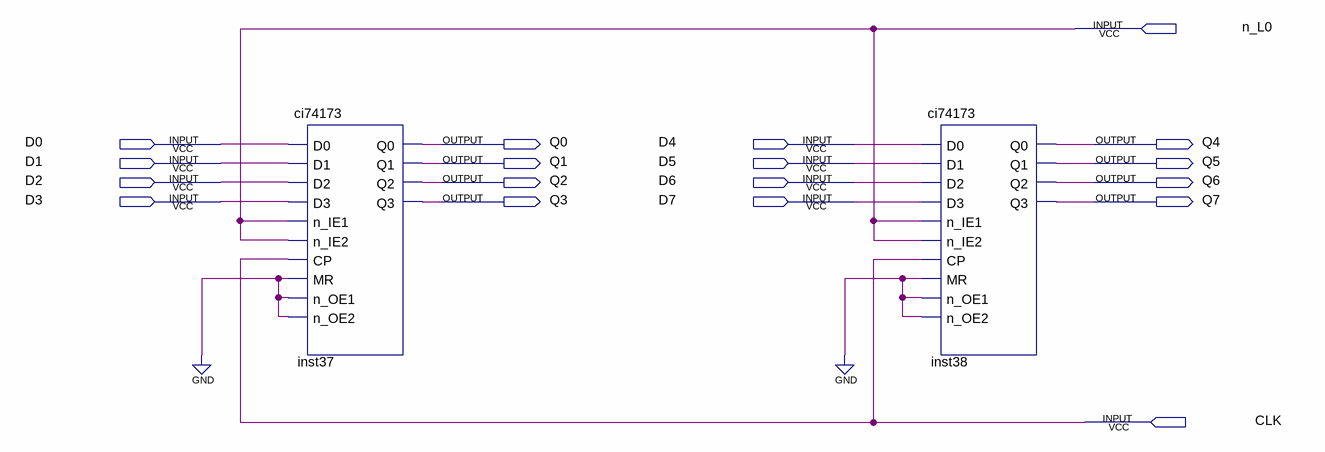
[diagram p0: schematic sheet]
// Quartus schematic RegistradordeSaida.bdf as structural Verilog: 2 symbols, 18 pins
module RegistradordeSaida (
  input  n_L0,
  input  D0,
  input  D4,
  input  D1,
  input  D5,
  input  D2,
  input  D6,
  input  D3,
  input  D7,
  input  CLK,
  output Q0,
  output Q4,
  output Q1,
  output Q5,
  output Q2,
  output Q6,
  output Q3,
  output Q7
);

  ci74173 inst37 (
    .D0(D0), .D1(D1), .D2(D2), .D3(D3), .n_IE1(n_L0), .n_IE2(n_L0), .CP(CLK), .MR(1'b0), .n_OE1(1'b0),
    .n_OE2(1'b0), .Q0(Q0), .Q1(Q1), .Q2(Q2), .Q3(Q3));
  ci74173 inst38 (
    .D0(D4), .D1(D5), .D2(D6), .D3(D7), .n_IE1(n_L0), .n_IE2(n_L0), .CP(CLK), .MR(1'b0), .n_OE1(1'b0),
    .n_OE2(1'b0), .Q0(Q4), .Q1(Q5), .Q2(Q6), .Q3(Q7));
endmodule
